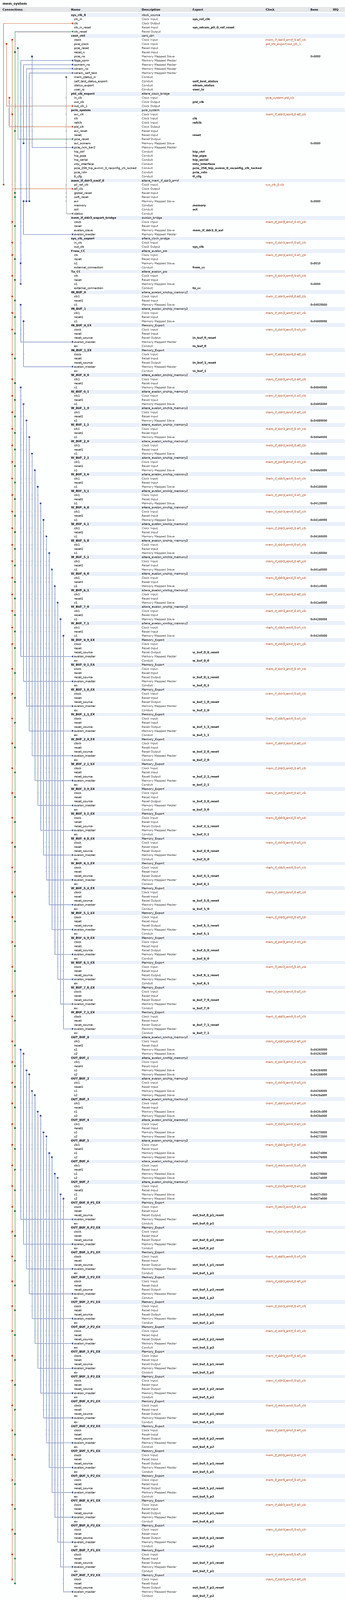
[diagram p0: system contents, whole]
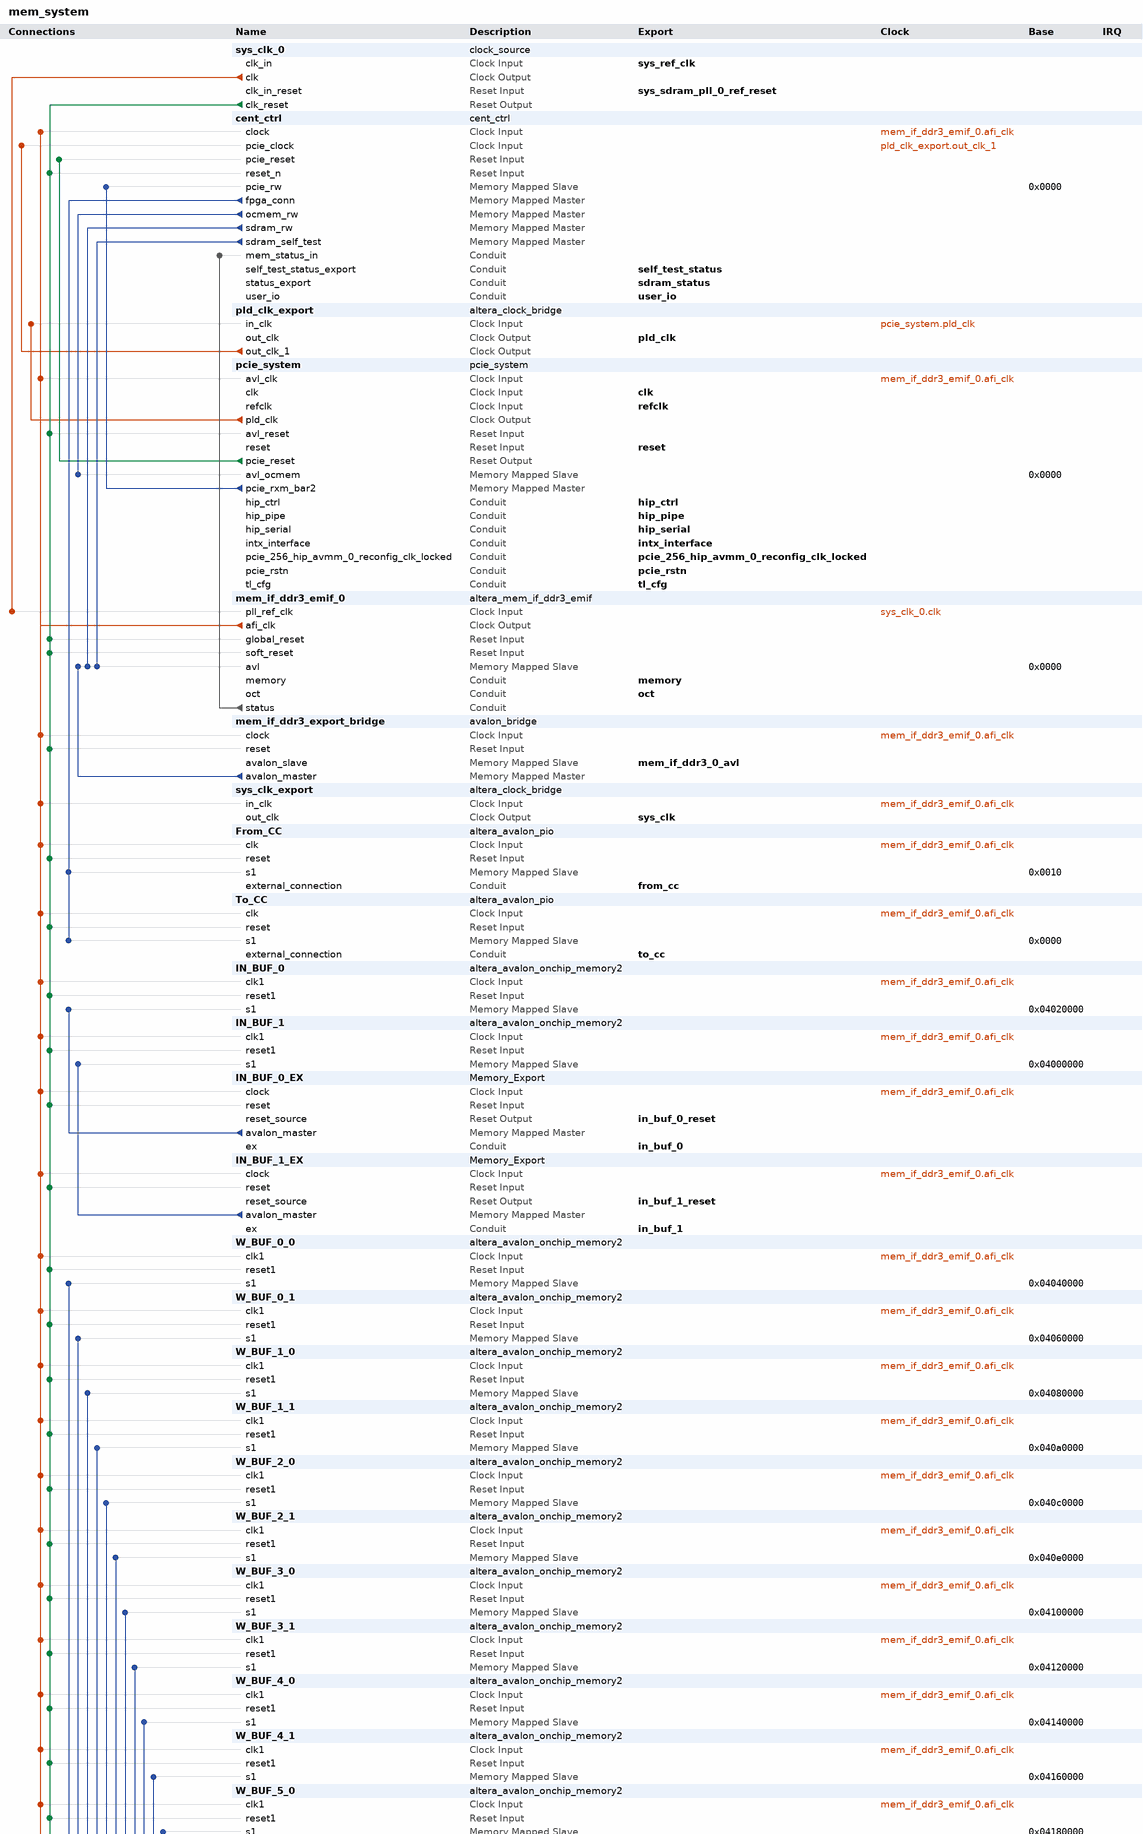
[diagram p1: system contents, upper part]
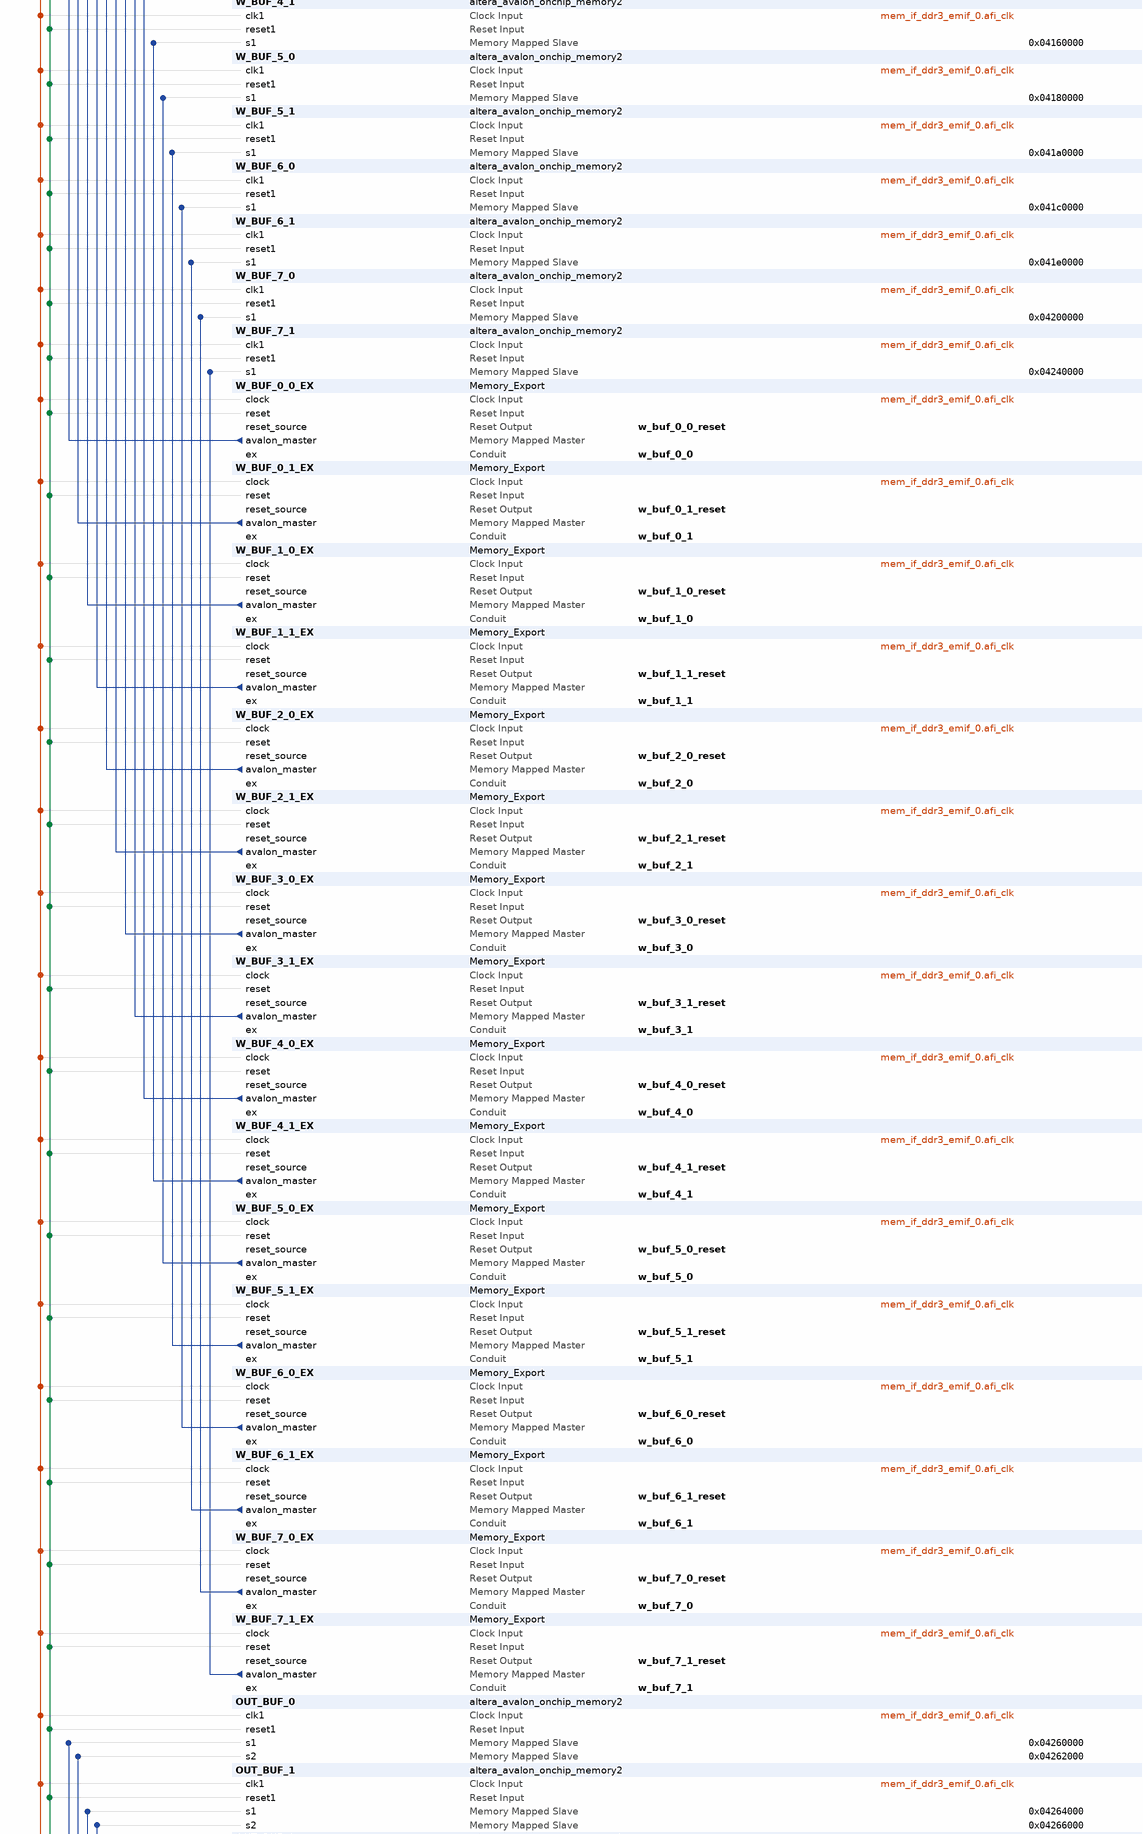
[diagram p2: system contents, middle part]
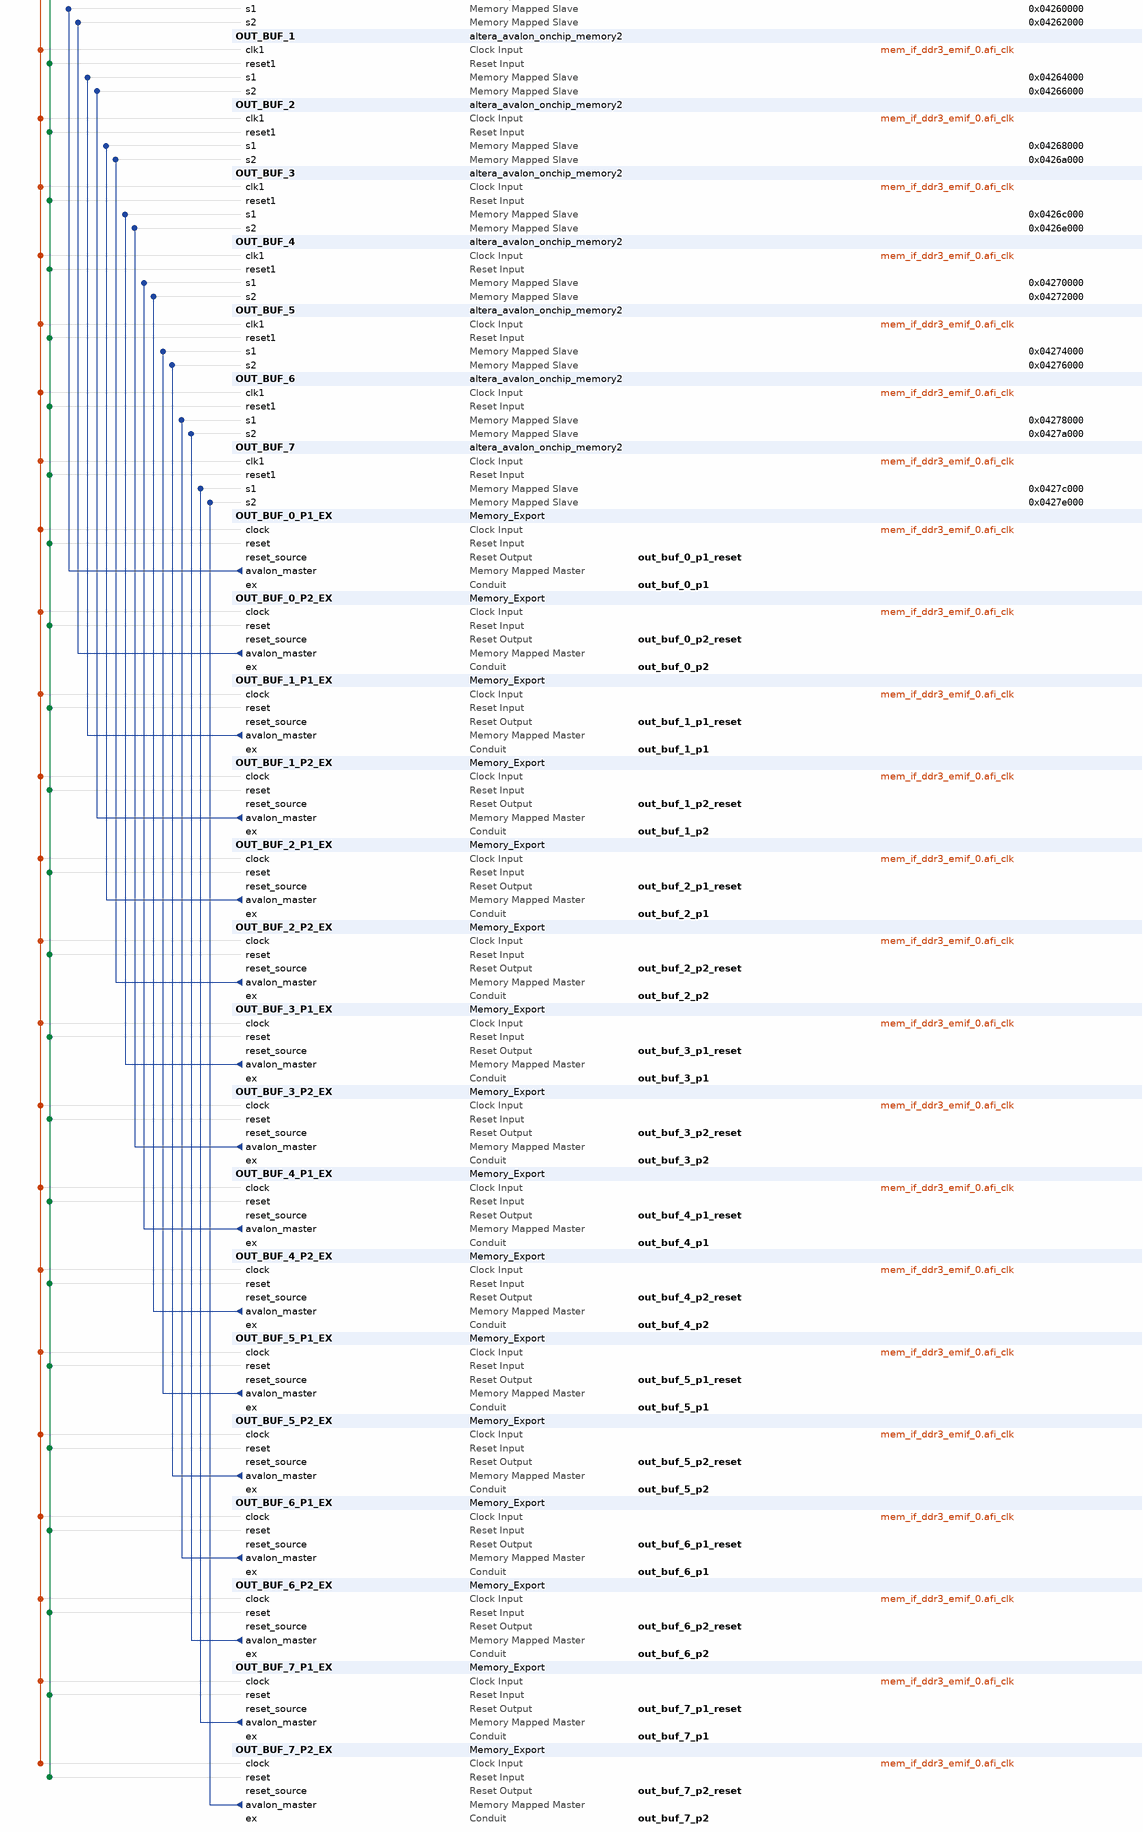
[diagram p3: system contents, lower part]
# Platform Designer (Qsys) system mem_system, Stratix V 5SGXEA7N2F45C2
# Parameters at their usual value, and those the tool derives, are not listed.
package require -exact qsys 16.0
create_system mem_system
set_project_property DEVICE_FAMILY {Stratix V}
set_project_property DEVICE 5SGXEA7N2F45C2

add_instance sys_clk_0 clock_source 16.0
set_instance_parameter_value sys_clk_0 clockFrequency 50000000
set_instance_parameter_value sys_clk_0 resetSynchronousEdges DEASSERT

add_instance cent_ctrl cent_ctrl 1.1

add_instance pld_clk_export altera_clock_bridge 16.0
set_instance_parameter_value pld_clk_export DERIVED_CLOCK_RATE 250000000
set_instance_parameter_value pld_clk_export EXPLICIT_CLOCK_RATE 0
set_instance_parameter_value pld_clk_export NUM_CLOCK_OUTPUTS 2

add_instance pcie_system pcie_system 1.0

add_instance mem_if_ddr3_emif_0 altera_mem_if_ddr3_emif 16.0
set_instance_parameter_value mem_if_ddr3_emif_0 AVL_MAX_SIZE 1
set_instance_parameter_value mem_if_ddr3_emif_0 CALIBRATION_MODE Skip
set_instance_parameter_value mem_if_ddr3_emif_0 CPORT_TYPE_PORT Bidirectional,Bidirectional,Bidirectional,Bidirectional,Bidirectional,Bidirectional
set_instance_parameter_value mem_if_ddr3_emif_0 EXPORT_AFI_HALF_CLK false
set_instance_parameter_value mem_if_ddr3_emif_0 HARD_EMIF false
set_instance_parameter_value mem_if_ddr3_emif_0 MEM_BANKADDR_WIDTH 3
set_instance_parameter_value mem_if_ddr3_emif_0 MEM_CK_WIDTH 2
set_instance_parameter_value mem_if_ddr3_emif_0 MEM_CLK_FREQ 400.0
set_instance_parameter_value mem_if_ddr3_emif_0 MEM_CLK_FREQ_MAX 800.0
set_instance_parameter_value mem_if_ddr3_emif_0 MEM_COL_ADDR_WIDTH 10
set_instance_parameter_value mem_if_ddr3_emif_0 MEM_DQ_WIDTH 8
set_instance_parameter_value mem_if_ddr3_emif_0 MEM_FORMAT UNBUFFERED
set_instance_parameter_value mem_if_ddr3_emif_0 MEM_ROW_ADDR_WIDTH 15
set_instance_parameter_value mem_if_ddr3_emif_0 MEM_RTT_NOM RZQ/2
set_instance_parameter_value mem_if_ddr3_emif_0 MEM_TCL 11
set_instance_parameter_value mem_if_ddr3_emif_0 MEM_TFAW_NS 30.0
set_instance_parameter_value mem_if_ddr3_emif_0 MEM_TRAS_NS 35.0
set_instance_parameter_value mem_if_ddr3_emif_0 MEM_TRCD_NS 13.75
set_instance_parameter_value mem_if_ddr3_emif_0 MEM_TRFC_NS 160.0
set_instance_parameter_value mem_if_ddr3_emif_0 MEM_TRP_NS 13.75
set_instance_parameter_value mem_if_ddr3_emif_0 MEM_TRRD_NS 6.0
set_instance_parameter_value mem_if_ddr3_emif_0 MEM_TRTP_NS 7.5
set_instance_parameter_value mem_if_ddr3_emif_0 MEM_TWTR 4
set_instance_parameter_value mem_if_ddr3_emif_0 MEM_VENDOR Samsung
set_instance_parameter_value mem_if_ddr3_emif_0 MEM_WTCL 8
set_instance_parameter_value mem_if_ddr3_emif_0 PLL_LOCATION Top_Bottom
set_instance_parameter_value mem_if_ddr3_emif_0 POWER_OF_TWO_BUS false
set_instance_parameter_value mem_if_ddr3_emif_0 PRIORITY_PORT 1,1,1,1,1,1
set_instance_parameter_value mem_if_ddr3_emif_0 RATE Quarter
set_instance_parameter_value mem_if_ddr3_emif_0 REF_CLK_FREQ 50.0
set_instance_parameter_value mem_if_ddr3_emif_0 SPEED_GRADE 2
set_instance_parameter_value mem_if_ddr3_emif_0 TIMING_BOARD_AC_SKEW 0.02
set_instance_parameter_value mem_if_ddr3_emif_0 TIMING_BOARD_AC_TO_CK_SKEW 0.0
set_instance_parameter_value mem_if_ddr3_emif_0 TIMING_BOARD_DQ_TO_DQS_SKEW 0.0
set_instance_parameter_value mem_if_ddr3_emif_0 TIMING_BOARD_MAX_CK_DELAY 0.6
set_instance_parameter_value mem_if_ddr3_emif_0 TIMING_BOARD_MAX_DQS_DELAY 0.6
set_instance_parameter_value mem_if_ddr3_emif_0 TIMING_BOARD_SKEW_BETWEEN_DQS 0.02
set_instance_parameter_value mem_if_ddr3_emif_0 TIMING_BOARD_SKEW_CKDQS_DIMM_MAX 0.01
set_instance_parameter_value mem_if_ddr3_emif_0 TIMING_BOARD_SKEW_CKDQS_DIMM_MIN -0.01
set_instance_parameter_value mem_if_ddr3_emif_0 TIMING_BOARD_SKEW_WITHIN_DQS 0.02
set_instance_parameter_value mem_if_ddr3_emif_0 TIMING_TDH 45
set_instance_parameter_value mem_if_ddr3_emif_0 TIMING_TDQSCK 225
set_instance_parameter_value mem_if_ddr3_emif_0 TIMING_TDQSQ 100
set_instance_parameter_value mem_if_ddr3_emif_0 TIMING_TDQSS 0.27
set_instance_parameter_value mem_if_ddr3_emif_0 TIMING_TDS 10
set_instance_parameter_value mem_if_ddr3_emif_0 TIMING_TDSH 0.18
set_instance_parameter_value mem_if_ddr3_emif_0 TIMING_TDSS 0.18
set_instance_parameter_value mem_if_ddr3_emif_0 TIMING_TIH 120
set_instance_parameter_value mem_if_ddr3_emif_0 TIMING_TIS 170
set_instance_parameter_value mem_if_ddr3_emif_0 TIMING_TQSH 0.4
set_instance_parameter_value mem_if_ddr3_emif_0 USER_DEBUG_LEVEL 1

add_instance mem_if_ddr3_export_bridge avalon_bridge 1.0
set_instance_parameter_value mem_if_ddr3_export_bridge ADDR_WIDTH 25
set_instance_parameter_value mem_if_ddr3_export_bridge BE_WIDTH_M 8
set_instance_parameter_value mem_if_ddr3_export_bridge BE_WIDTH_S 8
set_instance_parameter_value mem_if_ddr3_export_bridge DATA_WIDTH_M 64
set_instance_parameter_value mem_if_ddr3_export_bridge DATA_WIDTH_S 64
set_instance_parameter_value mem_if_ddr3_export_bridge MAX_BSIZE 1

add_instance sys_clk_export altera_clock_bridge 16.0
set_instance_parameter_value sys_clk_export DERIVED_CLOCK_RATE 100000000
set_instance_parameter_value sys_clk_export EXPLICIT_CLOCK_RATE 0

add_instance From_CC altera_avalon_pio 16.0
set_instance_parameter_value From_CC direction Output
set_instance_parameter_value From_CC width 16

add_instance To_CC altera_avalon_pio 16.0
set_instance_parameter_value To_CC captureEdge true
set_instance_parameter_value To_CC direction Input
set_instance_parameter_value To_CC width 8

add_instance IN_BUF_0 altera_avalon_onchip_memory2 16.0
set_instance_parameter_value IN_BUF_0 dataWidth 16
set_instance_parameter_value IN_BUF_0 dualPort false
set_instance_parameter_value IN_BUF_0 initMemContent false
set_instance_parameter_value IN_BUF_0 initializationFileName onchip_mem.hex
set_instance_parameter_value IN_BUF_0 memorySize 103058

add_instance IN_BUF_1 altera_avalon_onchip_memory2 16.0
set_instance_parameter_value IN_BUF_1 dataWidth 16
set_instance_parameter_value IN_BUF_1 dualPort false
set_instance_parameter_value IN_BUF_1 initMemContent false
set_instance_parameter_value IN_BUF_1 initializationFileName onchip_mem.hex
set_instance_parameter_value IN_BUF_1 memorySize 103058

add_instance IN_BUF_0_EX Memory_Export 1.0

add_instance IN_BUF_1_EX Memory_Export 1.0

add_instance W_BUF_0_0 altera_avalon_onchip_memory2 16.0
set_instance_parameter_value W_BUF_0_0 dataWidth 16
set_instance_parameter_value W_BUF_0_0 dualPort false
set_instance_parameter_value W_BUF_0_0 initMemContent false
set_instance_parameter_value W_BUF_0_0 initializationFileName onchip_mem.hex
set_instance_parameter_value W_BUF_0_0 memorySize 242

add_instance W_BUF_0_1 altera_avalon_onchip_memory2 16.0
set_instance_parameter_value W_BUF_0_1 dataWidth 16
set_instance_parameter_value W_BUF_0_1 dualPort false
set_instance_parameter_value W_BUF_0_1 initMemContent false
set_instance_parameter_value W_BUF_0_1 initializationFileName onchip_mem.hex
set_instance_parameter_value W_BUF_0_1 memorySize 242

add_instance W_BUF_1_0 altera_avalon_onchip_memory2 16.0
set_instance_parameter_value W_BUF_1_0 dataWidth 16
set_instance_parameter_value W_BUF_1_0 dualPort false
set_instance_parameter_value W_BUF_1_0 initMemContent false
set_instance_parameter_value W_BUF_1_0 initializationFileName onchip_mem.hex
set_instance_parameter_value W_BUF_1_0 memorySize 242

add_instance W_BUF_1_1 altera_avalon_onchip_memory2 16.0
set_instance_parameter_value W_BUF_1_1 dataWidth 16
set_instance_parameter_value W_BUF_1_1 dualPort false
set_instance_parameter_value W_BUF_1_1 initMemContent false
set_instance_parameter_value W_BUF_1_1 initializationFileName onchip_mem.hex
set_instance_parameter_value W_BUF_1_1 memorySize 242

add_instance W_BUF_2_0 altera_avalon_onchip_memory2 16.0
set_instance_parameter_value W_BUF_2_0 dataWidth 16
set_instance_parameter_value W_BUF_2_0 dualPort false
set_instance_parameter_value W_BUF_2_0 initMemContent false
set_instance_parameter_value W_BUF_2_0 initializationFileName onchip_mem.hex
set_instance_parameter_value W_BUF_2_0 memorySize 242

add_instance W_BUF_2_1 altera_avalon_onchip_memory2 16.0
set_instance_parameter_value W_BUF_2_1 dataWidth 16
set_instance_parameter_value W_BUF_2_1 dualPort false
set_instance_parameter_value W_BUF_2_1 initMemContent false
set_instance_parameter_value W_BUF_2_1 initializationFileName onchip_mem.hex
set_instance_parameter_value W_BUF_2_1 memorySize 242

add_instance W_BUF_3_0 altera_avalon_onchip_memory2 16.0
set_instance_parameter_value W_BUF_3_0 dataWidth 16
set_instance_parameter_value W_BUF_3_0 dualPort false
set_instance_parameter_value W_BUF_3_0 initMemContent false
set_instance_parameter_value W_BUF_3_0 initializationFileName onchip_mem.hex
set_instance_parameter_value W_BUF_3_0 memorySize 242

add_instance W_BUF_3_1 altera_avalon_onchip_memory2 16.0
set_instance_parameter_value W_BUF_3_1 dataWidth 16
set_instance_parameter_value W_BUF_3_1 dualPort false
set_instance_parameter_value W_BUF_3_1 initMemContent false
set_instance_parameter_value W_BUF_3_1 initializationFileName onchip_mem.hex
set_instance_parameter_value W_BUF_3_1 memorySize 242

add_instance W_BUF_4_0 altera_avalon_onchip_memory2 16.0
set_instance_parameter_value W_BUF_4_0 dataWidth 16
set_instance_parameter_value W_BUF_4_0 dualPort false
set_instance_parameter_value W_BUF_4_0 initMemContent false
set_instance_parameter_value W_BUF_4_0 initializationFileName onchip_mem.hex
set_instance_parameter_value W_BUF_4_0 memorySize 242

add_instance W_BUF_4_1 altera_avalon_onchip_memory2 16.0
set_instance_parameter_value W_BUF_4_1 dataWidth 16
set_instance_parameter_value W_BUF_4_1 dualPort false
set_instance_parameter_value W_BUF_4_1 initMemContent false
set_instance_parameter_value W_BUF_4_1 initializationFileName onchip_mem.hex
set_instance_parameter_value W_BUF_4_1 memorySize 242

add_instance W_BUF_5_0 altera_avalon_onchip_memory2 16.0
set_instance_parameter_value W_BUF_5_0 dataWidth 16
set_instance_parameter_value W_BUF_5_0 dualPort false
set_instance_parameter_value W_BUF_5_0 initMemContent false
set_instance_parameter_value W_BUF_5_0 initializationFileName onchip_mem.hex
set_instance_parameter_value W_BUF_5_0 memorySize 242

add_instance W_BUF_5_1 altera_avalon_onchip_memory2 16.0
set_instance_parameter_value W_BUF_5_1 dataWidth 16
set_instance_parameter_value W_BUF_5_1 dualPort false
set_instance_parameter_value W_BUF_5_1 initMemContent false
set_instance_parameter_value W_BUF_5_1 initializationFileName onchip_mem.hex
set_instance_parameter_value W_BUF_5_1 memorySize 242

add_instance W_BUF_6_0 altera_avalon_onchip_memory2 16.0
set_instance_parameter_value W_BUF_6_0 dataWidth 16
set_instance_parameter_value W_BUF_6_0 dualPort false
set_instance_parameter_value W_BUF_6_0 initMemContent false
set_instance_parameter_value W_BUF_6_0 initializationFileName onchip_mem.hex
set_instance_parameter_value W_BUF_6_0 memorySize 242

add_instance W_BUF_6_1 altera_avalon_onchip_memory2 16.0
set_instance_parameter_value W_BUF_6_1 dataWidth 16
set_instance_parameter_value W_BUF_6_1 dualPort false
set_instance_parameter_value W_BUF_6_1 initMemContent false
set_instance_parameter_value W_BUF_6_1 initializationFileName onchip_mem.hex
set_instance_parameter_value W_BUF_6_1 memorySize 242

add_instance W_BUF_7_0 altera_avalon_onchip_memory2 16.0
set_instance_parameter_value W_BUF_7_0 dataWidth 16
set_instance_parameter_value W_BUF_7_0 dualPort false
set_instance_parameter_value W_BUF_7_0 initMemContent false
set_instance_parameter_value W_BUF_7_0 initializationFileName onchip_mem.hex
set_instance_parameter_value W_BUF_7_0 memorySize 242

add_instance W_BUF_7_1 altera_avalon_onchip_memory2 16.0
set_instance_parameter_value W_BUF_7_1 dataWidth 16
set_instance_parameter_value W_BUF_7_1 dualPort false
set_instance_parameter_value W_BUF_7_1 initMemContent false
set_instance_parameter_value W_BUF_7_1 initializationFileName onchip_mem.hex
set_instance_parameter_value W_BUF_7_1 memorySize 242

add_instance W_BUF_0_0_EX Memory_Export 1.0

add_instance W_BUF_0_1_EX Memory_Export 1.0

add_instance W_BUF_1_0_EX Memory_Export 1.0

add_instance W_BUF_1_1_EX Memory_Export 1.0

add_instance W_BUF_2_0_EX Memory_Export 1.0

add_instance W_BUF_2_1_EX Memory_Export 1.0

add_instance W_BUF_3_0_EX Memory_Export 1.0

add_instance W_BUF_3_1_EX Memory_Export 1.0

add_instance W_BUF_4_0_EX Memory_Export 1.0

add_instance W_BUF_4_1_EX Memory_Export 1.0

add_instance W_BUF_5_0_EX Memory_Export 1.0

add_instance W_BUF_5_1_EX Memory_Export 1.0

add_instance W_BUF_6_0_EX Memory_Export 1.0

add_instance W_BUF_6_1_EX Memory_Export 1.0

add_instance W_BUF_7_0_EX Memory_Export 1.0

add_instance W_BUF_7_1_EX Memory_Export 1.0

add_instance OUT_BUF_0 altera_avalon_onchip_memory2 16.0
set_instance_parameter_value OUT_BUF_0 dataWidth 16
set_instance_parameter_value OUT_BUF_0 dualPort true
set_instance_parameter_value OUT_BUF_0 initMemContent false
set_instance_parameter_value OUT_BUF_0 initializationFileName onchip_mem.hex
set_instance_parameter_value OUT_BUF_0 memorySize 6050
set_instance_parameter_value OUT_BUF_0 singleClockOperation true

add_instance OUT_BUF_1 altera_avalon_onchip_memory2 16.0
set_instance_parameter_value OUT_BUF_1 dataWidth 16
set_instance_parameter_value OUT_BUF_1 dualPort true
set_instance_parameter_value OUT_BUF_1 initMemContent false
set_instance_parameter_value OUT_BUF_1 initializationFileName onchip_mem.hex
set_instance_parameter_value OUT_BUF_1 memorySize 6050
set_instance_parameter_value OUT_BUF_1 singleClockOperation true

add_instance OUT_BUF_2 altera_avalon_onchip_memory2 16.0
set_instance_parameter_value OUT_BUF_2 dataWidth 16
set_instance_parameter_value OUT_BUF_2 dualPort true
set_instance_parameter_value OUT_BUF_2 initMemContent false
set_instance_parameter_value OUT_BUF_2 initializationFileName onchip_mem.hex
set_instance_parameter_value OUT_BUF_2 memorySize 6050
set_instance_parameter_value OUT_BUF_2 singleClockOperation true

add_instance OUT_BUF_3 altera_avalon_onchip_memory2 16.0
set_instance_parameter_value OUT_BUF_3 dataWidth 16
set_instance_parameter_value OUT_BUF_3 dualPort true
set_instance_parameter_value OUT_BUF_3 initMemContent false
set_instance_parameter_value OUT_BUF_3 initializationFileName onchip_mem.hex
set_instance_parameter_value OUT_BUF_3 memorySize 6050
set_instance_parameter_value OUT_BUF_3 singleClockOperation true

add_instance OUT_BUF_4 altera_avalon_onchip_memory2 16.0
set_instance_parameter_value OUT_BUF_4 dataWidth 16
set_instance_parameter_value OUT_BUF_4 dualPort true
set_instance_parameter_value OUT_BUF_4 initMemContent false
set_instance_parameter_value OUT_BUF_4 initializationFileName onchip_mem.hex
set_instance_parameter_value OUT_BUF_4 memorySize 6050
set_instance_parameter_value OUT_BUF_4 singleClockOperation true

add_instance OUT_BUF_5 altera_avalon_onchip_memory2 16.0
set_instance_parameter_value OUT_BUF_5 dataWidth 16
set_instance_parameter_value OUT_BUF_5 dualPort true
set_instance_parameter_value OUT_BUF_5 initMemContent false
set_instance_parameter_value OUT_BUF_5 initializationFileName onchip_mem.hex
set_instance_parameter_value OUT_BUF_5 memorySize 6050
set_instance_parameter_value OUT_BUF_5 singleClockOperation true

add_instance OUT_BUF_6 altera_avalon_onchip_memory2 16.0
set_instance_parameter_value OUT_BUF_6 dataWidth 16
set_instance_parameter_value OUT_BUF_6 dualPort true
set_instance_parameter_value OUT_BUF_6 initMemContent false
set_instance_parameter_value OUT_BUF_6 initializationFileName onchip_mem.hex
set_instance_parameter_value OUT_BUF_6 memorySize 6050
set_instance_parameter_value OUT_BUF_6 singleClockOperation true

add_instance OUT_BUF_7 altera_avalon_onchip_memory2 16.0
set_instance_parameter_value OUT_BUF_7 dataWidth 16
set_instance_parameter_value OUT_BUF_7 dualPort true
set_instance_parameter_value OUT_BUF_7 initMemContent false
set_instance_parameter_value OUT_BUF_7 initializationFileName onchip_mem.hex
set_instance_parameter_value OUT_BUF_7 memorySize 6050
set_instance_parameter_value OUT_BUF_7 singleClockOperation true

add_instance OUT_BUF_0_P1_EX Memory_Export 1.0

add_instance OUT_BUF_0_P2_EX Memory_Export 1.0

add_instance OUT_BUF_1_P1_EX Memory_Export 1.0

add_instance OUT_BUF_1_P2_EX Memory_Export 1.0

add_instance OUT_BUF_2_P1_EX Memory_Export 1.0

add_instance OUT_BUF_2_P2_EX Memory_Export 1.0

add_instance OUT_BUF_3_P1_EX Memory_Export 1.0

add_instance OUT_BUF_3_P2_EX Memory_Export 1.0

add_instance OUT_BUF_4_P1_EX Memory_Export 1.0

add_instance OUT_BUF_4_P2_EX Memory_Export 1.0

add_instance OUT_BUF_5_P1_EX Memory_Export 1.0

add_instance OUT_BUF_5_P2_EX Memory_Export 1.0

add_instance OUT_BUF_6_P1_EX Memory_Export 1.0

add_instance OUT_BUF_6_P2_EX Memory_Export 1.0

add_instance OUT_BUF_7_P1_EX Memory_Export 1.0

add_instance OUT_BUF_7_P2_EX Memory_Export 1.0

# connections
add_connection mem_if_ddr3_emif_0.afi_clk cent_ctrl.clock clock
add_connection mem_if_ddr3_emif_0.afi_clk From_CC.clk clock
add_connection mem_if_ddr3_emif_0.afi_clk IN_BUF_0.clk1 clock
add_connection mem_if_ddr3_emif_0.afi_clk IN_BUF_0_EX.clock clock
add_connection mem_if_ddr3_emif_0.afi_clk IN_BUF_1.clk1 clock
add_connection mem_if_ddr3_emif_0.afi_clk IN_BUF_1_EX.clock clock
add_connection mem_if_ddr3_emif_0.afi_clk mem_if_ddr3_export_bridge.clock clock
add_connection mem_if_ddr3_emif_0.afi_clk OUT_BUF_0.clk1 clock
add_connection mem_if_ddr3_emif_0.afi_clk OUT_BUF_0_P1_EX.clock clock
add_connection mem_if_ddr3_emif_0.afi_clk OUT_BUF_0_P2_EX.clock clock
add_connection mem_if_ddr3_emif_0.afi_clk OUT_BUF_1.clk1 clock
add_connection mem_if_ddr3_emif_0.afi_clk OUT_BUF_1_P1_EX.clock clock
add_connection mem_if_ddr3_emif_0.afi_clk OUT_BUF_1_P2_EX.clock clock
add_connection mem_if_ddr3_emif_0.afi_clk OUT_BUF_2.clk1 clock
add_connection mem_if_ddr3_emif_0.afi_clk OUT_BUF_2_P1_EX.clock clock
add_connection mem_if_ddr3_emif_0.afi_clk OUT_BUF_2_P2_EX.clock clock
add_connection mem_if_ddr3_emif_0.afi_clk OUT_BUF_3.clk1 clock
add_connection mem_if_ddr3_emif_0.afi_clk OUT_BUF_3_P1_EX.clock clock
add_connection mem_if_ddr3_emif_0.afi_clk OUT_BUF_3_P2_EX.clock clock
add_connection mem_if_ddr3_emif_0.afi_clk OUT_BUF_4.clk1 clock
add_connection mem_if_ddr3_emif_0.afi_clk OUT_BUF_4_P1_EX.clock clock
add_connection mem_if_ddr3_emif_0.afi_clk OUT_BUF_4_P2_EX.clock clock
add_connection mem_if_ddr3_emif_0.afi_clk OUT_BUF_5.clk1 clock
add_connection mem_if_ddr3_emif_0.afi_clk OUT_BUF_5_P1_EX.clock clock
add_connection mem_if_ddr3_emif_0.afi_clk OUT_BUF_5_P2_EX.clock clock
add_connection mem_if_ddr3_emif_0.afi_clk OUT_BUF_6.clk1 clock
add_connection mem_if_ddr3_emif_0.afi_clk OUT_BUF_6_P1_EX.clock clock
add_connection mem_if_ddr3_emif_0.afi_clk OUT_BUF_6_P2_EX.clock clock
add_connection mem_if_ddr3_emif_0.afi_clk OUT_BUF_7.clk1 clock
add_connection mem_if_ddr3_emif_0.afi_clk OUT_BUF_7_P1_EX.clock clock
add_connection mem_if_ddr3_emif_0.afi_clk OUT_BUF_7_P2_EX.clock clock
add_connection mem_if_ddr3_emif_0.afi_clk pcie_system.avl_clk clock
add_connection mem_if_ddr3_emif_0.afi_clk sys_clk_export.in_clk clock
add_connection mem_if_ddr3_emif_0.afi_clk To_CC.clk clock
add_connection mem_if_ddr3_emif_0.afi_clk W_BUF_0_0.clk1 clock
add_connection mem_if_ddr3_emif_0.afi_clk W_BUF_0_0_EX.clock clock
add_connection mem_if_ddr3_emif_0.afi_clk W_BUF_0_1.clk1 clock
add_connection mem_if_ddr3_emif_0.afi_clk W_BUF_0_1_EX.clock clock
add_connection mem_if_ddr3_emif_0.afi_clk W_BUF_1_0.clk1 clock
add_connection mem_if_ddr3_emif_0.afi_clk W_BUF_1_0_EX.clock clock
add_connection mem_if_ddr3_emif_0.afi_clk W_BUF_1_1.clk1 clock
add_connection mem_if_ddr3_emif_0.afi_clk W_BUF_1_1_EX.clock clock
add_connection mem_if_ddr3_emif_0.afi_clk W_BUF_2_0.clk1 clock
add_connection mem_if_ddr3_emif_0.afi_clk W_BUF_2_0_EX.clock clock
add_connection mem_if_ddr3_emif_0.afi_clk W_BUF_2_1.clk1 clock
add_connection mem_if_ddr3_emif_0.afi_clk W_BUF_2_1_EX.clock clock
add_connection mem_if_ddr3_emif_0.afi_clk W_BUF_3_0.clk1 clock
add_connection mem_if_ddr3_emif_0.afi_clk W_BUF_3_0_EX.clock clock
add_connection mem_if_ddr3_emif_0.afi_clk W_BUF_3_1.clk1 clock
add_connection mem_if_ddr3_emif_0.afi_clk W_BUF_3_1_EX.clock clock
add_connection mem_if_ddr3_emif_0.afi_clk W_BUF_4_0.clk1 clock
add_connection mem_if_ddr3_emif_0.afi_clk W_BUF_4_0_EX.clock clock
add_connection mem_if_ddr3_emif_0.afi_clk W_BUF_4_1.clk1 clock
add_connection mem_if_ddr3_emif_0.afi_clk W_BUF_4_1_EX.clock clock
add_connection mem_if_ddr3_emif_0.afi_clk W_BUF_5_0.clk1 clock
add_connection mem_if_ddr3_emif_0.afi_clk W_BUF_5_0_EX.clock clock
add_connection mem_if_ddr3_emif_0.afi_clk W_BUF_5_1.clk1 clock
add_connection mem_if_ddr3_emif_0.afi_clk W_BUF_5_1_EX.clock clock
add_connection mem_if_ddr3_emif_0.afi_clk W_BUF_6_0.clk1 clock
add_connection mem_if_ddr3_emif_0.afi_clk W_BUF_6_0_EX.clock clock
add_connection mem_if_ddr3_emif_0.afi_clk W_BUF_6_1.clk1 clock
add_connection mem_if_ddr3_emif_0.afi_clk W_BUF_6_1_EX.clock clock
add_connection mem_if_ddr3_emif_0.afi_clk W_BUF_7_0.clk1 clock
add_connection mem_if_ddr3_emif_0.afi_clk W_BUF_7_0_EX.clock clock
add_connection mem_if_ddr3_emif_0.afi_clk W_BUF_7_1.clk1 clock
add_connection mem_if_ddr3_emif_0.afi_clk W_BUF_7_1_EX.clock clock
add_connection pcie_system.pld_clk pld_clk_export.in_clk clock
add_connection pld_clk_export.out_clk_1 cent_ctrl.pcie_clock clock
add_connection sys_clk_0.clk mem_if_ddr3_emif_0.pll_ref_clk clock
add_connection pcie_system.pcie_reset cent_ctrl.pcie_reset reset
add_connection sys_clk_0.clk_reset cent_ctrl.reset_n reset
add_connection sys_clk_0.clk_reset From_CC.reset reset
add_connection sys_clk_0.clk_reset IN_BUF_0.reset1 reset
add_connection sys_clk_0.clk_reset IN_BUF_0_EX.reset reset
add_connection sys_clk_0.clk_reset IN_BUF_1.reset1 reset
add_connection sys_clk_0.clk_reset IN_BUF_1_EX.reset reset
add_connection sys_clk_0.clk_reset mem_if_ddr3_emif_0.global_reset reset
add_connection sys_clk_0.clk_reset mem_if_ddr3_emif_0.soft_reset reset
add_connection sys_clk_0.clk_reset mem_if_ddr3_export_bridge.reset reset
add_connection sys_clk_0.clk_reset OUT_BUF_0.reset1 reset
add_connection sys_clk_0.clk_reset OUT_BUF_0_P1_EX.reset reset
add_connection sys_clk_0.clk_reset OUT_BUF_0_P2_EX.reset reset
add_connection sys_clk_0.clk_reset OUT_BUF_1.reset1 reset
add_connection sys_clk_0.clk_reset OUT_BUF_1_P1_EX.reset reset
add_connection sys_clk_0.clk_reset OUT_BUF_1_P2_EX.reset reset
add_connection sys_clk_0.clk_reset OUT_BUF_2.reset1 reset
add_connection sys_clk_0.clk_reset OUT_BUF_2_P1_EX.reset reset
add_connection sys_clk_0.clk_reset OUT_BUF_2_P2_EX.reset reset
add_connection sys_clk_0.clk_reset OUT_BUF_3.reset1 reset
add_connection sys_clk_0.clk_reset OUT_BUF_3_P1_EX.reset reset
add_connection sys_clk_0.clk_reset OUT_BUF_3_P2_EX.reset reset
add_connection sys_clk_0.clk_reset OUT_BUF_4.reset1 reset
add_connection sys_clk_0.clk_reset OUT_BUF_4_P1_EX.reset reset
add_connection sys_clk_0.clk_reset OUT_BUF_4_P2_EX.reset reset
add_connection sys_clk_0.clk_reset OUT_BUF_5.reset1 reset
add_connection sys_clk_0.clk_reset OUT_BUF_5_P1_EX.reset reset
add_connection sys_clk_0.clk_reset OUT_BUF_5_P2_EX.reset reset
add_connection sys_clk_0.clk_reset OUT_BUF_6.reset1 reset
add_connection sys_clk_0.clk_reset OUT_BUF_6_P1_EX.reset reset
add_connection sys_clk_0.clk_reset OUT_BUF_6_P2_EX.reset reset
add_connection sys_clk_0.clk_reset OUT_BUF_7.reset1 reset
add_connection sys_clk_0.clk_reset OUT_BUF_7_P1_EX.reset reset
add_connection sys_clk_0.clk_reset OUT_BUF_7_P2_EX.reset reset
add_connection sys_clk_0.clk_reset pcie_system.avl_reset reset
add_connection sys_clk_0.clk_reset To_CC.reset reset
add_connection sys_clk_0.clk_reset W_BUF_0_0.reset1 reset
add_connection sys_clk_0.clk_reset W_BUF_0_0_EX.reset reset
add_connection sys_clk_0.clk_reset W_BUF_0_1.reset1 reset
add_connection sys_clk_0.clk_reset W_BUF_0_1_EX.reset reset
add_connection sys_clk_0.clk_reset W_BUF_1_0.reset1 reset
add_connection sys_clk_0.clk_reset W_BUF_1_0_EX.reset reset
add_connection sys_clk_0.clk_reset W_BUF_1_1.reset1 reset
add_connection sys_clk_0.clk_reset W_BUF_1_1_EX.reset reset
add_connection sys_clk_0.clk_reset W_BUF_2_0.reset1 reset
add_connection sys_clk_0.clk_reset W_BUF_2_0_EX.reset reset
add_connection sys_clk_0.clk_reset W_BUF_2_1.reset1 reset
add_connection sys_clk_0.clk_reset W_BUF_2_1_EX.reset reset
add_connection sys_clk_0.clk_reset W_BUF_3_0.reset1 reset
add_connection sys_clk_0.clk_reset W_BUF_3_0_EX.reset reset
add_connection sys_clk_0.clk_reset W_BUF_3_1.reset1 reset
add_connection sys_clk_0.clk_reset W_BUF_3_1_EX.reset reset
add_connection sys_clk_0.clk_reset W_BUF_4_0.reset1 reset
add_connection sys_clk_0.clk_reset W_BUF_4_0_EX.reset reset
add_connection sys_clk_0.clk_reset W_BUF_4_1.reset1 reset
add_connection sys_clk_0.clk_reset W_BUF_4_1_EX.reset reset
add_connection sys_clk_0.clk_reset W_BUF_5_0.reset1 reset
add_connection sys_clk_0.clk_reset W_BUF_5_0_EX.reset reset
add_connection sys_clk_0.clk_reset W_BUF_5_1.reset1 reset
add_connection sys_clk_0.clk_reset W_BUF_5_1_EX.reset reset
add_connection sys_clk_0.clk_reset W_BUF_6_0.reset1 reset
add_connection sys_clk_0.clk_reset W_BUF_6_0_EX.reset reset
add_connection sys_clk_0.clk_reset W_BUF_6_1.reset1 reset
add_connection sys_clk_0.clk_reset W_BUF_6_1_EX.reset reset
add_connection sys_clk_0.clk_reset W_BUF_7_0.reset1 reset
add_connection sys_clk_0.clk_reset W_BUF_7_0_EX.reset reset
add_connection sys_clk_0.clk_reset W_BUF_7_1.reset1 reset
add_connection sys_clk_0.clk_reset W_BUF_7_1_EX.reset reset
add_connection cent_ctrl.fpga_conn From_CC.s1 avalon
set_connection_parameter_value cent_ctrl.fpga_conn/From_CC.s1 baseAddress 0x0010
add_connection cent_ctrl.fpga_conn To_CC.s1 avalon
set_connection_parameter_value cent_ctrl.fpga_conn/To_CC.s1 baseAddress 0x0000
add_connection cent_ctrl.ocmem_rw pcie_system.avl_ocmem avalon
set_connection_parameter_value cent_ctrl.ocmem_rw/pcie_system.avl_ocmem baseAddress 0x0000
add_connection cent_ctrl.sdram_rw mem_if_ddr3_emif_0.avl avalon
set_connection_parameter_value cent_ctrl.sdram_rw/mem_if_ddr3_emif_0.avl baseAddress 0x0000
add_connection cent_ctrl.sdram_self_test mem_if_ddr3_emif_0.avl avalon
set_connection_parameter_value cent_ctrl.sdram_self_test/mem_if_ddr3_emif_0.avl baseAddress 0x0000
add_connection IN_BUF_0_EX.avalon_master IN_BUF_0.s1 avalon
set_connection_parameter_value IN_BUF_0_EX.avalon_master/IN_BUF_0.s1 baseAddress 0x04020000
add_connection IN_BUF_1_EX.avalon_master IN_BUF_1.s1 avalon
set_connection_parameter_value IN_BUF_1_EX.avalon_master/IN_BUF_1.s1 baseAddress 0x04000000
add_connection mem_if_ddr3_export_bridge.avalon_master mem_if_ddr3_emif_0.avl avalon
set_connection_parameter_value mem_if_ddr3_export_bridge.avalon_master/mem_if_ddr3_emif_0.avl baseAddress 0x0000
add_connection OUT_BUF_0_P1_EX.avalon_master OUT_BUF_0.s1 avalon
set_connection_parameter_value OUT_BUF_0_P1_EX.avalon_master/OUT_BUF_0.s1 baseAddress 0x04260000
add_connection OUT_BUF_0_P2_EX.avalon_master OUT_BUF_0.s2 avalon
set_connection_parameter_value OUT_BUF_0_P2_EX.avalon_master/OUT_BUF_0.s2 baseAddress 0x04262000
add_connection OUT_BUF_1_P1_EX.avalon_master OUT_BUF_1.s1 avalon
set_connection_parameter_value OUT_BUF_1_P1_EX.avalon_master/OUT_BUF_1.s1 baseAddress 0x04264000
add_connection OUT_BUF_1_P2_EX.avalon_master OUT_BUF_1.s2 avalon
set_connection_parameter_value OUT_BUF_1_P2_EX.avalon_master/OUT_BUF_1.s2 baseAddress 0x04266000
add_connection OUT_BUF_2_P1_EX.avalon_master OUT_BUF_2.s1 avalon
set_connection_parameter_value OUT_BUF_2_P1_EX.avalon_master/OUT_BUF_2.s1 baseAddress 0x04268000
add_connection OUT_BUF_2_P2_EX.avalon_master OUT_BUF_2.s2 avalon
set_connection_parameter_value OUT_BUF_2_P2_EX.avalon_master/OUT_BUF_2.s2 baseAddress 0x0426a000
add_connection OUT_BUF_3_P1_EX.avalon_master OUT_BUF_3.s1 avalon
set_connection_parameter_value OUT_BUF_3_P1_EX.avalon_master/OUT_BUF_3.s1 baseAddress 0x0426c000
add_connection OUT_BUF_3_P2_EX.avalon_master OUT_BUF_3.s2 avalon
set_connection_parameter_value OUT_BUF_3_P2_EX.avalon_master/OUT_BUF_3.s2 baseAddress 0x0426e000
add_connection OUT_BUF_4_P1_EX.avalon_master OUT_BUF_4.s1 avalon
set_connection_parameter_value OUT_BUF_4_P1_EX.avalon_master/OUT_BUF_4.s1 baseAddress 0x04270000
add_connection OUT_BUF_4_P2_EX.avalon_master OUT_BUF_4.s2 avalon
set_connection_parameter_value OUT_BUF_4_P2_EX.avalon_master/OUT_BUF_4.s2 baseAddress 0x04272000
add_connection OUT_BUF_5_P1_EX.avalon_master OUT_BUF_5.s1 avalon
set_connection_parameter_value OUT_BUF_5_P1_EX.avalon_master/OUT_BUF_5.s1 baseAddress 0x04274000
add_connection OUT_BUF_5_P2_EX.avalon_master OUT_BUF_5.s2 avalon
set_connection_parameter_value OUT_BUF_5_P2_EX.avalon_master/OUT_BUF_5.s2 baseAddress 0x04276000
add_connection OUT_BUF_6_P1_EX.avalon_master OUT_BUF_6.s1 avalon
set_connection_parameter_value OUT_BUF_6_P1_EX.avalon_master/OUT_BUF_6.s1 baseAddress 0x04278000
add_connection OUT_BUF_6_P2_EX.avalon_master OUT_BUF_6.s2 avalon
set_connection_parameter_value OUT_BUF_6_P2_EX.avalon_master/OUT_BUF_6.s2 baseAddress 0x0427a000
add_connection OUT_BUF_7_P1_EX.avalon_master OUT_BUF_7.s1 avalon
set_connection_parameter_value OUT_BUF_7_P1_EX.avalon_master/OUT_BUF_7.s1 baseAddress 0x0427c000
add_connection OUT_BUF_7_P2_EX.avalon_master OUT_BUF_7.s2 avalon
set_connection_parameter_value OUT_BUF_7_P2_EX.avalon_master/OUT_BUF_7.s2 baseAddress 0x0427e000
add_connection pcie_system.pcie_rxm_bar2 cent_ctrl.pcie_rw avalon
set_connection_parameter_value pcie_system.pcie_rxm_bar2/cent_ctrl.pcie_rw baseAddress 0x0000
add_connection W_BUF_0_0_EX.avalon_master W_BUF_0_0.s1 avalon
set_connection_parameter_value W_BUF_0_0_EX.avalon_master/W_BUF_0_0.s1 baseAddress 0x04040000
add_connection W_BUF_0_1_EX.avalon_master W_BUF_0_1.s1 avalon
set_connection_parameter_value W_BUF_0_1_EX.avalon_master/W_BUF_0_1.s1 baseAddress 0x04060000
add_connection W_BUF_1_0_EX.avalon_master W_BUF_1_0.s1 avalon
set_connection_parameter_value W_BUF_1_0_EX.avalon_master/W_BUF_1_0.s1 baseAddress 0x04080000
add_connection W_BUF_1_1_EX.avalon_master W_BUF_1_1.s1 avalon
set_connection_parameter_value W_BUF_1_1_EX.avalon_master/W_BUF_1_1.s1 baseAddress 0x040a0000
add_connection W_BUF_2_0_EX.avalon_master W_BUF_2_0.s1 avalon
set_connection_parameter_value W_BUF_2_0_EX.avalon_master/W_BUF_2_0.s1 baseAddress 0x040c0000
add_connection W_BUF_2_1_EX.avalon_master W_BUF_2_1.s1 avalon
set_connection_parameter_value W_BUF_2_1_EX.avalon_master/W_BUF_2_1.s1 baseAddress 0x040e0000
add_connection W_BUF_3_0_EX.avalon_master W_BUF_3_0.s1 avalon
set_connection_parameter_value W_BUF_3_0_EX.avalon_master/W_BUF_3_0.s1 baseAddress 0x04100000
add_connection W_BUF_3_1_EX.avalon_master W_BUF_3_1.s1 avalon
set_connection_parameter_value W_BUF_3_1_EX.avalon_master/W_BUF_3_1.s1 baseAddress 0x04120000
add_connection W_BUF_4_0_EX.avalon_master W_BUF_4_0.s1 avalon
set_connection_parameter_value W_BUF_4_0_EX.avalon_master/W_BUF_4_0.s1 baseAddress 0x04140000
add_connection W_BUF_4_1_EX.avalon_master W_BUF_4_1.s1 avalon
set_connection_parameter_value W_BUF_4_1_EX.avalon_master/W_BUF_4_1.s1 baseAddress 0x04160000
add_connection W_BUF_5_0_EX.avalon_master W_BUF_5_0.s1 avalon
set_connection_parameter_value W_BUF_5_0_EX.avalon_master/W_BUF_5_0.s1 baseAddress 0x04180000
add_connection W_BUF_5_1_EX.avalon_master W_BUF_5_1.s1 avalon
set_connection_parameter_value W_BUF_5_1_EX.avalon_master/W_BUF_5_1.s1 baseAddress 0x041a0000
add_connection W_BUF_6_0_EX.avalon_master W_BUF_6_0.s1 avalon
set_connection_parameter_value W_BUF_6_0_EX.avalon_master/W_BUF_6_0.s1 baseAddress 0x041c0000
add_connection W_BUF_6_1_EX.avalon_master W_BUF_6_1.s1 avalon
set_connection_parameter_value W_BUF_6_1_EX.avalon_master/W_BUF_6_1.s1 baseAddress 0x041e0000
add_connection W_BUF_7_0_EX.avalon_master W_BUF_7_0.s1 avalon
set_connection_parameter_value W_BUF_7_0_EX.avalon_master/W_BUF_7_0.s1 baseAddress 0x04200000
add_connection W_BUF_7_1_EX.avalon_master W_BUF_7_1.s1 avalon
set_connection_parameter_value W_BUF_7_1_EX.avalon_master/W_BUF_7_1.s1 baseAddress 0x04240000
add_connection mem_if_ddr3_emif_0.status cent_ctrl.mem_status_in conduit

# exported interfaces
add_interface clk clock sink
set_interface_property clk EXPORT_OF pcie_system.clk
add_interface from_cc conduit end
set_interface_property from_cc EXPORT_OF From_CC.external_connection
add_interface hip_ctrl conduit end
set_interface_property hip_ctrl EXPORT_OF pcie_system.hip_ctrl
add_interface hip_pipe conduit end
set_interface_property hip_pipe EXPORT_OF pcie_system.hip_pipe
add_interface hip_serial conduit end
set_interface_property hip_serial EXPORT_OF pcie_system.hip_serial
add_interface in_buf_0 conduit end
set_interface_property in_buf_0 EXPORT_OF IN_BUF_0_EX.ex
add_interface in_buf_0_reset reset source
set_interface_property in_buf_0_reset EXPORT_OF IN_BUF_0_EX.reset_source
add_interface in_buf_1 conduit end
set_interface_property in_buf_1 EXPORT_OF IN_BUF_1_EX.ex
add_interface in_buf_1_reset reset source
set_interface_property in_buf_1_reset EXPORT_OF IN_BUF_1_EX.reset_source
add_interface intx_interface conduit end
set_interface_property intx_interface EXPORT_OF pcie_system.intx_interface
add_interface mem_if_ddr3_0_avl avalon slave
set_interface_property mem_if_ddr3_0_avl EXPORT_OF mem_if_ddr3_export_bridge.avalon_slave
add_interface memory conduit end
set_interface_property memory EXPORT_OF mem_if_ddr3_emif_0.memory
add_interface oct conduit end
set_interface_property oct EXPORT_OF mem_if_ddr3_emif_0.oct
add_interface out_buf_0_p1 conduit end
set_interface_property out_buf_0_p1 EXPORT_OF OUT_BUF_0_P1_EX.ex
add_interface out_buf_0_p1_reset reset source
set_interface_property out_buf_0_p1_reset EXPORT_OF OUT_BUF_0_P1_EX.reset_source
add_interface out_buf_0_p2 conduit end
set_interface_property out_buf_0_p2 EXPORT_OF OUT_BUF_0_P2_EX.ex
add_interface out_buf_0_p2_reset reset source
set_interface_property out_buf_0_p2_reset EXPORT_OF OUT_BUF_0_P2_EX.reset_source
add_interface out_buf_1_p1 conduit end
set_interface_property out_buf_1_p1 EXPORT_OF OUT_BUF_1_P1_EX.ex
add_interface out_buf_1_p1_reset reset source
set_interface_property out_buf_1_p1_reset EXPORT_OF OUT_BUF_1_P1_EX.reset_source
add_interface out_buf_1_p2 conduit end
set_interface_property out_buf_1_p2 EXPORT_OF OUT_BUF_1_P2_EX.ex
add_interface out_buf_1_p2_reset reset source
set_interface_property out_buf_1_p2_reset EXPORT_OF OUT_BUF_1_P2_EX.reset_source
add_interface out_buf_2_p1 conduit end
set_interface_property out_buf_2_p1 EXPORT_OF OUT_BUF_2_P1_EX.ex
add_interface out_buf_2_p1_reset reset source
set_interface_property out_buf_2_p1_reset EXPORT_OF OUT_BUF_2_P1_EX.reset_source
add_interface out_buf_2_p2 conduit end
set_interface_property out_buf_2_p2 EXPORT_OF OUT_BUF_2_P2_EX.ex
add_interface out_buf_2_p2_reset reset source
set_interface_property out_buf_2_p2_reset EXPORT_OF OUT_BUF_2_P2_EX.reset_source
add_interface out_buf_3_p1 conduit end
set_interface_property out_buf_3_p1 EXPORT_OF OUT_BUF_3_P1_EX.ex
add_interface out_buf_3_p1_reset reset source
set_interface_property out_buf_3_p1_reset EXPORT_OF OUT_BUF_3_P1_EX.reset_source
add_interface out_buf_3_p2 conduit end
set_interface_property out_buf_3_p2 EXPORT_OF OUT_BUF_3_P2_EX.ex
add_interface out_buf_3_p2_reset reset source
set_interface_property out_buf_3_p2_reset EXPORT_OF OUT_BUF_3_P2_EX.reset_source
add_interface out_buf_4_p1 conduit end
set_interface_property out_buf_4_p1 EXPORT_OF OUT_BUF_4_P1_EX.ex
add_interface out_buf_4_p1_reset reset source
set_interface_property out_buf_4_p1_reset EXPORT_OF OUT_BUF_4_P1_EX.reset_source
add_interface out_buf_4_p2 conduit end
set_interface_property out_buf_4_p2 EXPORT_OF OUT_BUF_4_P2_EX.ex
add_interface out_buf_4_p2_reset reset source
set_interface_property out_buf_4_p2_reset EXPORT_OF OUT_BUF_4_P2_EX.reset_source
add_interface out_buf_5_p1 conduit end
set_interface_property out_buf_5_p1 EXPORT_OF OUT_BUF_5_P1_EX.ex
add_interface out_buf_5_p1_reset reset source
set_interface_property out_buf_5_p1_reset EXPORT_OF OUT_BUF_5_P1_EX.reset_source
add_interface out_buf_5_p2 conduit end
set_interface_property out_buf_5_p2 EXPORT_OF OUT_BUF_5_P2_EX.ex
add_interface out_buf_5_p2_reset reset source
set_interface_property out_buf_5_p2_reset EXPORT_OF OUT_BUF_5_P2_EX.reset_source
add_interface out_buf_6_p1 conduit end
set_interface_property out_buf_6_p1 EXPORT_OF OUT_BUF_6_P1_EX.ex
add_interface out_buf_6_p1_reset reset source
set_interface_property out_buf_6_p1_reset EXPORT_OF OUT_BUF_6_P1_EX.reset_source
add_interface out_buf_6_p2 conduit end
set_interface_property out_buf_6_p2 EXPORT_OF OUT_BUF_6_P2_EX.ex
add_interface out_buf_6_p2_reset reset source
set_interface_property out_buf_6_p2_reset EXPORT_OF OUT_BUF_6_P2_EX.reset_source
add_interface out_buf_7_p1 conduit end
set_interface_property out_buf_7_p1 EXPORT_OF OUT_BUF_7_P1_EX.ex
add_interface out_buf_7_p1_reset reset source
set_interface_property out_buf_7_p1_reset EXPORT_OF OUT_BUF_7_P1_EX.reset_source
add_interface out_buf_7_p2 conduit end
set_interface_property out_buf_7_p2 EXPORT_OF OUT_BUF_7_P2_EX.ex
add_interface out_buf_7_p2_reset reset source
set_interface_property out_buf_7_p2_reset EXPORT_OF OUT_BUF_7_P2_EX.reset_source
add_interface pcie_256_hip_avmm_0_reconfig_clk_locked conduit end
set_interface_property pcie_256_hip_avmm_0_reconfig_clk_locked EXPORT_OF pcie_system.pcie_256_hip_avmm_0_reconfig_clk_locked
add_interface pcie_rstn conduit end
set_interface_property pcie_rstn EXPORT_OF pcie_system.pcie_rstn
add_interface pld_clk clock source
set_interface_property pld_clk EXPORT_OF pld_clk_export.out_clk
add_interface refclk clock sink
set_interface_property refclk EXPORT_OF pcie_system.refclk
add_interface reset reset sink
set_interface_property reset EXPORT_OF pcie_system.reset
add_interface sdram_status conduit end
set_interface_property sdram_status EXPORT_OF cent_ctrl.status_export
add_interface self_test_status conduit end
set_interface_property self_test_status EXPORT_OF cent_ctrl.self_test_status_export
add_interface sys_clk clock source
set_interface_property sys_clk EXPORT_OF sys_clk_export.out_clk
add_interface sys_ref_clk clock sink
set_interface_property sys_ref_clk EXPORT_OF sys_clk_0.clk_in
add_interface sys_sdram_pll_0_ref_reset reset sink
set_interface_property sys_sdram_pll_0_ref_reset EXPORT_OF sys_clk_0.clk_in_reset
add_interface tl_cfg conduit end
set_interface_property tl_cfg EXPORT_OF pcie_system.tl_cfg
add_interface to_cc conduit end
set_interface_property to_cc EXPORT_OF To_CC.external_connection
add_interface user_io conduit end
set_interface_property user_io EXPORT_OF cent_ctrl.user_io
add_interface w_buf_0_0 conduit end
set_interface_property w_buf_0_0 EXPORT_OF W_BUF_0_0_EX.ex
add_interface w_buf_0_0_reset reset source
set_interface_property w_buf_0_0_reset EXPORT_OF W_BUF_0_0_EX.reset_source
add_interface w_buf_0_1 conduit end
set_interface_property w_buf_0_1 EXPORT_OF W_BUF_0_1_EX.ex
add_interface w_buf_0_1_reset reset source
set_interface_property w_buf_0_1_reset EXPORT_OF W_BUF_0_1_EX.reset_source
add_interface w_buf_1_0 conduit end
set_interface_property w_buf_1_0 EXPORT_OF W_BUF_1_0_EX.ex
add_interface w_buf_1_0_reset reset source
set_interface_property w_buf_1_0_reset EXPORT_OF W_BUF_1_0_EX.reset_source
add_interface w_buf_1_1 conduit end
set_interface_property w_buf_1_1 EXPORT_OF W_BUF_1_1_EX.ex
add_interface w_buf_1_1_reset reset source
set_interface_property w_buf_1_1_reset EXPORT_OF W_BUF_1_1_EX.reset_source
add_interface w_buf_2_0 conduit end
set_interface_property w_buf_2_0 EXPORT_OF W_BUF_2_0_EX.ex
add_interface w_buf_2_0_reset reset source
set_interface_property w_buf_2_0_reset EXPORT_OF W_BUF_2_0_EX.reset_source
add_interface w_buf_2_1 conduit end
set_interface_property w_buf_2_1 EXPORT_OF W_BUF_2_1_EX.ex
add_interface w_buf_2_1_reset reset source
set_interface_property w_buf_2_1_reset EXPORT_OF W_BUF_2_1_EX.reset_source
add_interface w_buf_3_0 conduit end
set_interface_property w_buf_3_0 EXPORT_OF W_BUF_3_0_EX.ex
add_interface w_buf_3_0_reset reset source
set_interface_property w_buf_3_0_reset EXPORT_OF W_BUF_3_0_EX.reset_source
add_interface w_buf_3_1 conduit end
set_interface_property w_buf_3_1 EXPORT_OF W_BUF_3_1_EX.ex
add_interface w_buf_3_1_reset reset source
set_interface_property w_buf_3_1_reset EXPORT_OF W_BUF_3_1_EX.reset_source
add_interface w_buf_4_0 conduit end
set_interface_property w_buf_4_0 EXPORT_OF W_BUF_4_0_EX.ex
add_interface w_buf_4_0_reset reset source
set_interface_property w_buf_4_0_reset EXPORT_OF W_BUF_4_0_EX.reset_source
add_interface w_buf_4_1 conduit end
set_interface_property w_buf_4_1 EXPORT_OF W_BUF_4_1_EX.ex
add_interface w_buf_4_1_reset reset source
set_interface_property w_buf_4_1_reset EXPORT_OF W_BUF_4_1_EX.reset_source
add_interface w_buf_5_0 conduit end
set_interface_property w_buf_5_0 EXPORT_OF W_BUF_5_0_EX.ex
add_interface w_buf_5_0_reset reset source
set_interface_property w_buf_5_0_reset EXPORT_OF W_BUF_5_0_EX.reset_source
add_interface w_buf_5_1 conduit end
set_interface_property w_buf_5_1 EXPORT_OF W_BUF_5_1_EX.ex
add_interface w_buf_5_1_reset reset source
set_interface_property w_buf_5_1_reset EXPORT_OF W_BUF_5_1_EX.reset_source
add_interface w_buf_6_0 conduit end
set_interface_property w_buf_6_0 EXPORT_OF W_BUF_6_0_EX.ex
add_interface w_buf_6_0_reset reset source
set_interface_property w_buf_6_0_reset EXPORT_OF W_BUF_6_0_EX.reset_source
add_interface w_buf_6_1 conduit end
set_interface_property w_buf_6_1 EXPORT_OF W_BUF_6_1_EX.ex
add_interface w_buf_6_1_reset reset source
set_interface_property w_buf_6_1_reset EXPORT_OF W_BUF_6_1_EX.reset_source
add_interface w_buf_7_0 conduit end
set_interface_property w_buf_7_0 EXPORT_OF W_BUF_7_0_EX.ex
add_interface w_buf_7_0_reset reset source
set_interface_property w_buf_7_0_reset EXPORT_OF W_BUF_7_0_EX.reset_source
add_interface w_buf_7_1 conduit end
set_interface_property w_buf_7_1 EXPORT_OF W_BUF_7_1_EX.ex
add_interface w_buf_7_1_reset reset source
set_interface_property w_buf_7_1_reset EXPORT_OF W_BUF_7_1_EX.reset_source

set_interconnect_requirement {$system} qsys_mm.clockCrossingAdapter HANDSHAKE
set_interconnect_requirement {$system} qsys_mm.enableEccProtection FALSE
set_interconnect_requirement {$system} qsys_mm.insertDefaultSlave FALSE
set_interconnect_requirement {$system} qsys_mm.maxAdditionalLatency 1

save_system mem_system.qsys
